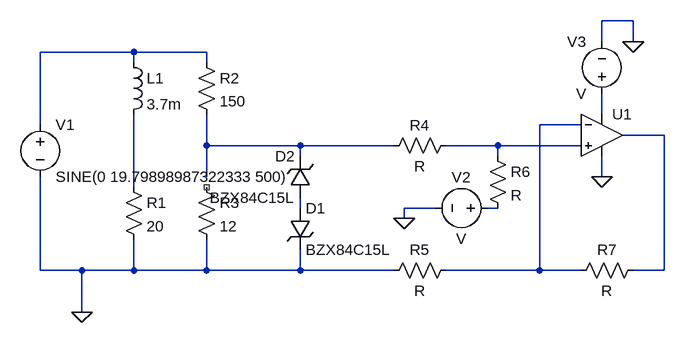
[diagram p0: schematic Lab2Task4.asc]
Lab2Task4.asc, the LTspice schematic file:
Version 4
SHEET 1 980 680
WIRE 928 -48 880 -48
WIRE 880 -16 880 -48
WIRE 928 -16 928 -48
WIRE 160 0 16 0
WIRE 272 0 160 0
WIRE 160 16 160 0
WIRE 272 16 272 0
WIRE 880 96 880 64
WIRE 16 112 16 0
WIRE 848 112 784 112
WIRE 976 128 912 128
WIRE 272 144 272 96
WIRE 416 144 272 144
WIRE 560 144 416 144
WIRE 720 144 640 144
WIRE 848 144 720 144
WIRE 416 160 416 144
WIRE 720 160 720 144
WIRE 272 192 272 144
WIRE 880 192 880 160
WIRE 160 208 160 96
WIRE 416 240 416 224
WIRE 624 240 576 240
WIRE 720 240 704 240
WIRE 576 256 576 240
WIRE 16 336 16 192
WIRE 80 336 16 336
WIRE 160 336 160 288
WIRE 160 336 80 336
WIRE 272 336 272 288
WIRE 272 336 160 336
WIRE 416 336 416 304
WIRE 416 336 272 336
WIRE 560 336 416 336
WIRE 784 336 784 112
WIRE 784 336 640 336
WIRE 848 336 784 336
WIRE 976 336 976 128
WIRE 976 336 928 336
WIRE 80 400 80 336
FLAG 80 400 0
FLAG 576 256 0
FLAG 928 -16 0
FLAG 880 192 0
SYMBOL voltage 16 96 R0
WINDOW 123 0 0 Left 2
WINDOW 39 0 0 Left 2
SYMATTR InstName V1
SYMATTR Value SINE(0 19.79898987322333 500)
SYMBOL ind 144 0 R0
SYMATTR InstName L1
SYMATTR Value 3.7m
SYMBOL res 144 192 R0
SYMATTR InstName R1
SYMATTR Value 20
SYMBOL res 256 0 R0
SYMATTR InstName R2
SYMATTR Value 150
SYMBOL res 256 192 R0
SYMATTR InstName R3
SYMATTR Value 12
SYMBOL zener 400 240 R0
SYMATTR InstName D1
SYMATTR Value BZX84C15L
SYMATTR Description Diode
SYMATTR Type diode
SYMBOL zener 432 224 R180
WINDOW 0 24 64 Left 2
WINDOW 3 24 0 Left 2
SYMATTR InstName D2
SYMATTR Value BZX84C15L
SYMATTR Description Diode
SYMATTR Type diode
SYMBOL res 656 128 R90
WINDOW 0 0 56 VBottom 2
WINDOW 3 32 56 VTop 2
SYMATTR InstName R4
SYMBOL res 656 320 R90
WINDOW 0 0 56 VBottom 2
WINDOW 3 32 56 VTop 2
SYMATTR InstName R5
SYMBOL res 704 144 R0
SYMATTR InstName R6
SYMBOL Opamps\\UniversalOpamp2 880 128 R0
SYMATTR InstName U1
SYMBOL voltage 720 240 R90
WINDOW 0 -32 56 VBottom 2
WINDOW 3 32 56 VTop 2
SYMATTR InstName V2
SYMBOL voltage 880 80 R180
WINDOW 0 24 96 Left 2
WINDOW 3 24 16 Left 2
SYMATTR InstName V3
SYMBOL res 944 320 R90
WINDOW 0 0 56 VBottom 2
WINDOW 3 32 56 VTop 2
SYMATTR InstName R7

The netlist it stands for:
* Lab2Task4.asc
V1 N001 0 SINE(0 19.79898987322333 500)
L1 N001 N007 3.7m
R1 N007 0 20
R2 N001 N005 150
R3 NC_01 0 12
D1 N008 0 BZX84C15L
D2 N008 N005 BZX84C15L
R4 N006 N005 R
R5 N003 0 R
R6 N006 N009 R
XU1 N006 N003 N002 0 N004 level.2 Avol=1Meg GBW=10Meg Slew=10Meg ilimit=25m rail=0 Vos=0 phimargin=45 en=0 enk=0 in=0 ink=0 Rin=500Meg  ; pins IN+ IN- V+ V- OUT
V2 N009 0 V
V3 N002 0 V
R7 N004 N003 R
.model D D
.lib standard.dio
.lib UniversalOpamps2.sub
.backanno
.end